# EAGLE design PowerMeter (EAGLE 7.3.0)
DATABASE: ../../../../digikeydb.txt
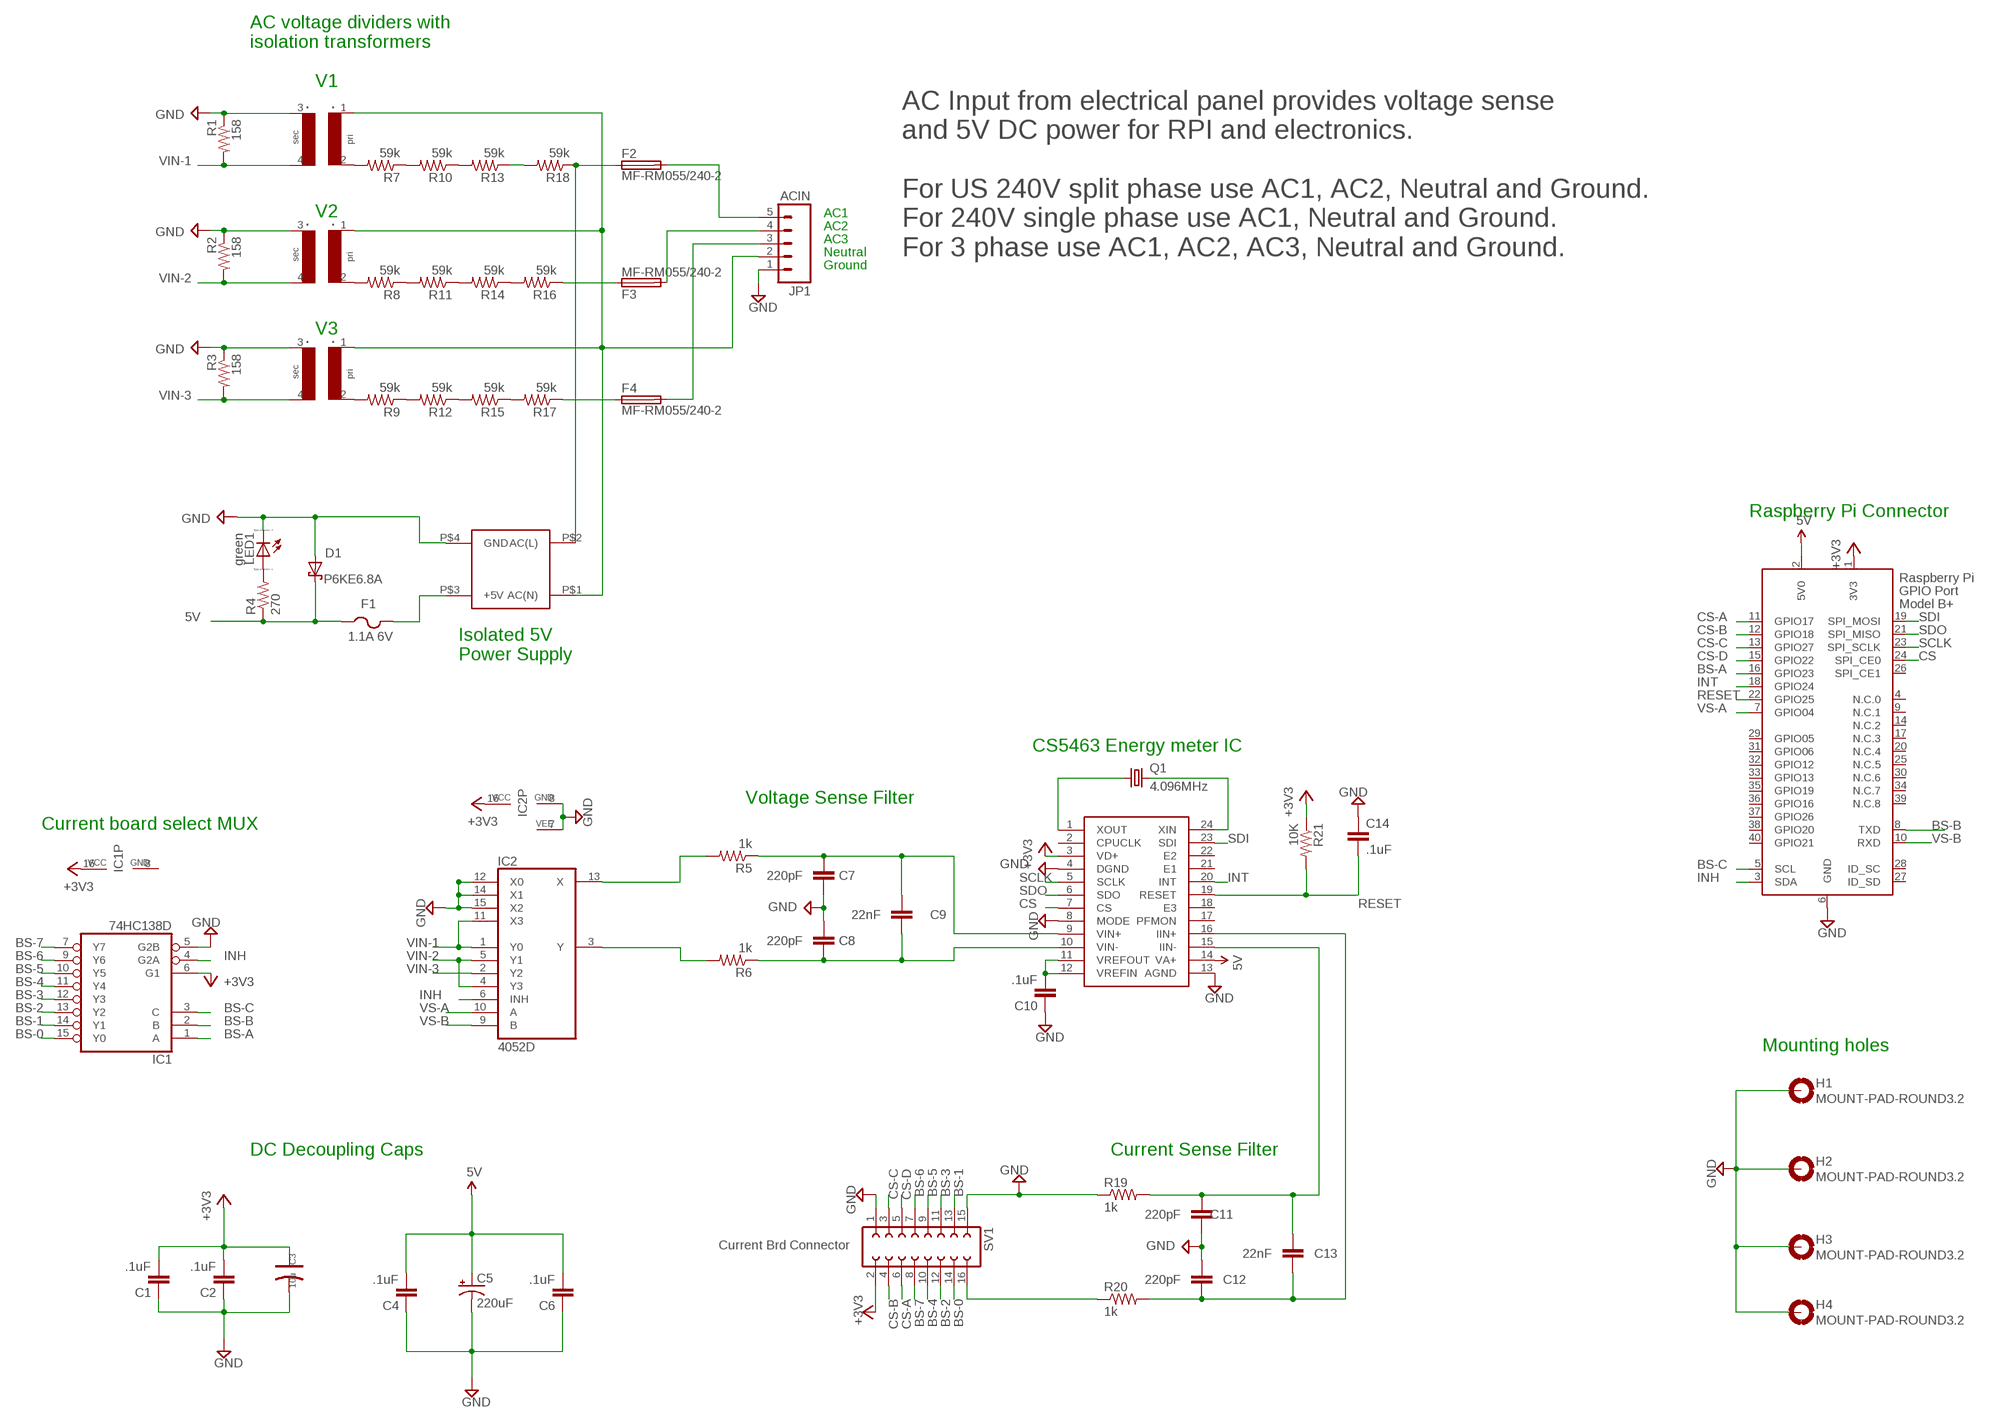
[diagram p0: schematic, sheet 1]

## Parts
C1  .1uF  C-EUC1206  [C1206]
C2  .1uF  C-EUC1206  [C1206]
C3  10u  CAP-AVX-C  [AVX-C]
C4  .1uF  C-EUC1206  [C1206]
C5  220uF  CPOL-USE2,5-6E  [E2,5-6E]
C6  .1uF  C-EUC1206  [C1206]
C7  220pF  C-EUC1206  [C1206]
C8  220pF  C-EUC1206  [C1206]
C9  22nF  C-EUC1206  [C1206]
C10  .1uF  C-EUC1206  [C1206]
C11  220pF  C-EUC1206  [C1206]
C12  220pF  C-EUC1206  [C1206]
C13  22nF  C-EUC1206  [C1206]
C14  .1uF  C-EUC1206  [C1206]
D1  P6KE6.8A  P6KEXXA  [C1702-15]
F1  1.1A 6V  PTCFUSE-1812  [1812]
F2  MF-RM055/240-2  FUSETE5  [TE5]
F3  MF-RM055/240-2  FUSETE5  [TE5]
F4  MF-RM055/240-2  FUSETE5  [TE5]
H1  MOUNT-PAD-ROUND3.2  [3,2-PAD]
H2  MOUNT-PAD-ROUND3.2  [3,2-PAD]
H3  MOUNT-PAD-ROUND3.2  [3,2-PAD]
H4  MOUNT-PAD-ROUND3.2  [3,2-PAD]
IC1  74HC138D  [SO16]
IC2  4052D  [SO16]
IC3  CS5463  [SSOP24]
JP1  ACIN  M05  [SCREWTERMINAL-5MM-5]
LED1  green  LED_E  [LED_1206]
PS1  VSK-S10  [VSK-S10]
Q1  4.096MHz  CRYSTALHC49S  [HC49/S]
R1  158  R-US_R1206  [R1206]
R2  158  R-US_R1206  [R1206]
R3  158  R-US_R1206  [R1206]
R4  270  R-US_R1206  [R1206]
R5  1k  R-US_R1206  [R1206]
R6  1k  R-US_R1206  [R1206]
R7  59k  R-US_R1206  [R1206]
R8  59k  R-US_R1206  [R1206]
R9  59k  R-US_R1206  [R1206]
R10  59k  R-US_R1206  [R1206]
R11  59k  R-US_R1206  [R1206]
R12  59k  R-US_R1206  [R1206]
R13  59k  R-US_R1206  [R1206]
R14  59k  R-US_R1206  [R1206]
R15  59k  R-US_R1206  [R1206]
R16  59k  R-US_R1206  [R1206]
R17  59k  R-US_R1206  [R1206]
R18  59k  R-US_R1206  [R1206]
R19  1k  R-US_R1206  [R1206]
R20  1k  R-US_R1206  [R1206]
R21  10K  R-US_R1206  [R1206]
SV1  Current Brd Connector  FE08-2  [FE08-2]
T1  TV16E  [TV16E]
T2  TV16E  [TV16E]
T3  TV16E  [TV16E]
X1  RASPI_BOARD_B+_E4  [RASPI_BOARD_B+_EDGES_4DRILL]

## Nets
5V: C4.2 C5.+ C6.2 D1.C F1.1 IC3.14(VA+) R4.1 X1.2(5V0)
+3V3: C1.2 C2.2 C3.+ IC1.6(G1) IC1.16(VCC) IC2.16(VCC) IC3.3(VD+) R21.1 SV1.2 X1.1(3V3)
+5V: F1.2 PS1.P$3(+5V)
AC(L) [ac line]: F2.1 PS1.P$2(AC(L)) R18.1
AC(N) [ac line]: JP1.2 PS1.P$1(AC(N)) T1.1 T2.1 T3.1
BS-0: IC1.15(Y0) SV1.14
BS-1: IC1.14(Y1) SV1.13
BS-2: IC1.13(Y2) SV1.12
BS-3: IC1.12(Y3) SV1.11
BS-4: IC1.11(Y4) SV1.10
BS-5: IC1.10(Y5) SV1.9
BS-6: IC1.9(Y6) SV1.7
BS-7: IC1.7(Y7) SV1.8
BS-A: IC1.1(A) X1.16(GPIO23)
BS-B: IC1.2(B) X1.8(TXD)
BS-C: IC1.3(C) X1.5(SCL)
C5: C12.1 C13.1 IC3.16(IIN+) R20.2
CS: IC3.7(CS) X1.24(SPI_CE0)
CS-A: SV1.6 X1.11(GPIO17)
CS-B: SV1.4 X1.12(GPIO18)
CS-C: SV1.3 X1.13(GPIO27)
CS-D: SV1.5 X1.15(GPIO22)
GND: C1.1 C2.1 C3.- C4.1 C5.- C6.1 C7.1 C8.2 C10.1 C11.1 C12.2 C14.1 D1.A H1.B3,2(MOUNT) H2.B3,2(MOUNT) H3.B3,2(MOUNT) H4.B3,2(MOUNT) IC1.5(G2B) IC2.7(VEE) IC2.8(GND) IC2.12(X0) IC2.14(X1) IC2.15(X2) IC3.4(DGND) IC3.8(MODE) IC3.13(AGND) JP1.1 LED1.C PS1.P$4(GND) R1.1 R2.1 R3.1 R19.1 SV1.1 SV1.15 T1.3 T2.3 T3.3 X1.6(GND)
IIN+: R20.1 SV1.16
INH: IC1.4(G2A) IC2.6(INH) X1.3(SDA)
INT: IC3.20(INT) X1.18(GPIO24)
N$1: IC3.1(XOUT) Q1.1
N$2 [ac line]: F3.1 R16.1
N$3 [ac line]: R7.1 R10.2
N$4 [ac line]: R10.1 R13.2
N$5 [ac line]: F4.2 JP1.3
N$6 [ac line]: R11.1 R14.2
N$7: LED1.A R4.2
N$8: C11.2 C13.2 IC3.15(IIN-) R19.2
N$9 [ac line]: F2.2 JP1.5
N$10 [ac line]: R15.1 R17.2
N$11 [ac line]: R9.2 T3.2
N$12: IC3.24(XIN) Q1.2
N$13 [ac line]: R9.1 R12.2
N$14 [ac line]: R12.1 R15.2
N$15 [ac line]: R8.2 T2.2
N$16 [ac line]: R8.1 R11.2
N$17: C10.2 IC3.11(VREFOUT) IC3.12(VREFIN)
N$18 [ac line]: R14.1 R16.2
N$19 [ac line]: R7.2 T1.2
N$20 [ac line]: R13.1 R18.2
N$21 [ac line]: F4.1 R17.1
N$23: IC2.13(X) R5.2
N$38 [ac line]: F3.2 JP1.4
N$39: IC2.3(Y) R6.2
N$46: C8.1 C9.1 IC3.10(VIN-) R6.1
R1: C7.2 C9.2 IC3.9(VIN+) R5.1
RESET: C14.2 IC3.19(RESET) R21.2 X1.22(GPIO25)
SCLK: IC3.5(SCLK) X1.23(SPI_SCLK)
SDI: IC3.23(SDI) X1.19(SPI_MOSI)
SDO: IC3.6(SDO) X1.21(SPI_MISO)
VIN-1: IC2.1(Y0) IC2.11(X3) R1.2 T1.4
VIN-2: IC2.4(Y3) IC2.5(Y1) R2.2 T2.4
VIN-3: IC2.2(Y2) R3.2 T3.4
VS-A: IC2.10(A) X1.7(GPIO04)
VS-B: IC2.9(B) X1.10(RXD)
Unconnected: IC3.2(CPUCLK) IC3.17(PFMON) IC3.18(E3) IC3.21(E1) IC3.22(E2) X1.4(N.C.0) X1.9(N.C.1) X1.14(N.C.2) X1.17(N.C.3) X1.20(N.C.4) X1.25(N.C.5) X1.26(SPI_CE1) X1.27(ID_SD) X1.28(ID_SC) X1.29(GPIO05) X1.30(N.C.6) X1.31(GPIO06) X1.32(GPIO12) X1.33(GPIO13) X1.34(N.C.7) X1.35(GPIO19) X1.36(GPIO16) X1.37(GPIO26) X1.38(GPIO20) X1.39(N.C.8) X1.40(GPIO21)

## Notes on the sheet
- AC voltage dividers with
  isolation transformers
- V1
- V2 | AC1
- AC2
- AC3
- Neutral
- AC Input from electrical panel provides voltage sense 
  and 5V DC power for RPI and electronics.
  
  For US 240V split phase use AC1, AC2, Neutral and Ground.
  For 240V single phase use AC1, Neutral and Ground.
  For 3 phase use AC1, AC2, AC3, Neutral and Ground.
- Ground
- V3
- Raspberry Pi Connector
- Isolated 5V
  Power Supply
- CS5463 Energy meter IC
- Voltage Sense Filter
- Current board select MUX
- Mounting holes
- DC Decoupling Caps | Current Sense Filter

## Power pins joined to a net without a drawn wire
GND: IC1.8(GND)

## Library data of the parts
C1 C2 C4 C6 C10 C14 = rcl:C-EU: CAPACITOR, European symbol; PARTNO: C1206C104K5RAC7867
C3 = Discrete:CAP*: Electrolytic Capacitors,Tantalum Capacitors and Super Capacitors; PARTNO: T491C106K016AT
C5 = adafruit:CPOL-US: POLARIZED CAPACITOR, American symbol; PARTNO: ESH227M016AE3AA
C7 C8 C11 C12 = rcl:C-EU: CAPACITOR, European symbol; PARTNO: C1206C221J5GACTU
C9 C13 = rcl:C-EU: CAPACITOR, European symbol; PARTNO: C1206C223K5RACTU
D1 = diode:P6KEXXA: DIODE transient-voltage suppressor; PARTNO: P6KE6.8A
F1 = adafruit:PTCFUSE: PTC fuses, resettable thermistors; PARTNO: 0ZCC0110AF2C
F2-F4 = fuse:FUSE: Fuse; OC_FARNELL: unknown; OC_NEWARK: unknown; PARTNO: MF-RM055/240-2
H1-H4 = holes:MOUNT-PAD-ROUND: MOUNTING PAD, round; BOM: EXCLUDE
IC1 = 74xx-eu:74*138: 3-line to 8-line DECODER/DEMULTIPLEXER; PARTNO: SN74HC138NSR
IC2 = 40xx:4052: Dual 4-channel ANALOG MULTIPLEXER; PARTNO: CD4052BNSR
IC3 = Cirrus_Logic_By_element14_Batch_1:CS5463; PARTNO: CS5463-ISZ
JP1 = SparkFun-Connectors:M05: Header 5 Standard 5-pin 0.1" header. Use with straight break away headers (SKU : PRT-00116), right angle break away headers (PRT-00553), swiss pins (PRT-00743), machine pins (PRT-00117), and female headers (PRT-00115). Molex polarized connector foot print use with SKU : PRT-08230 with associated crimp pins and housings.; PARTNO: 1935190
LED1 = eagle-ltspice:LED_E: LED Source: http://www.osram.convergy.de Source: www.luxeon.com Source: www.kingbright.com; PARTNO: LTST-C150GKT; SPICEMODEL: NONE; SPICEPREFIX: D; SPICETYPE: diode
PS1 = CraigJensen:VSK-S10; PARTNO: VSK-S5-5UA
Q1 = crystal:CRYSTAL: CRYSTAL; OC_FARNELL: 1667008; OC_NEWARK: unknown; PARTNO: 9B-4.096MBBK-B
R1-R3 = resistor:R-US_: RESISTOR, American symbol; PARTNO: RC1206FR-07158RL
R4 = resistor:R-US_: RESISTOR, American symbol; PARTNO: RC1206FR-07270RL
R5-R20 = resistor:R-US_: RESISTOR, American symbol; PARTNO: RC1206FR-071KL
R21 = resistor:R-US_: RESISTOR, American symbol; PARTNO: RC1206FR-0710KL
SV1 = con-lsta:FE08-2: FEMALE HEADER; OC_FARNELL: unknown; OC_NEWARK: unknown; PARTNO: PPTC082LFBN-RC
T1-T3 = CraigJensen:TV16E: YHDC TV16E Transformer
X1 = raspberrypi_bastelstube_v13:RASPI_BOARD_B+: Raspberry Pi GPIO connector with markings for the outer dimensions of the Raspberry Pi board model B+ with different sets of drill holes or mounting pads; PARTNO: M20-9762046

## Net classes
1 ac line: width 0.4 mm, clearance 1.2 mm

## Board
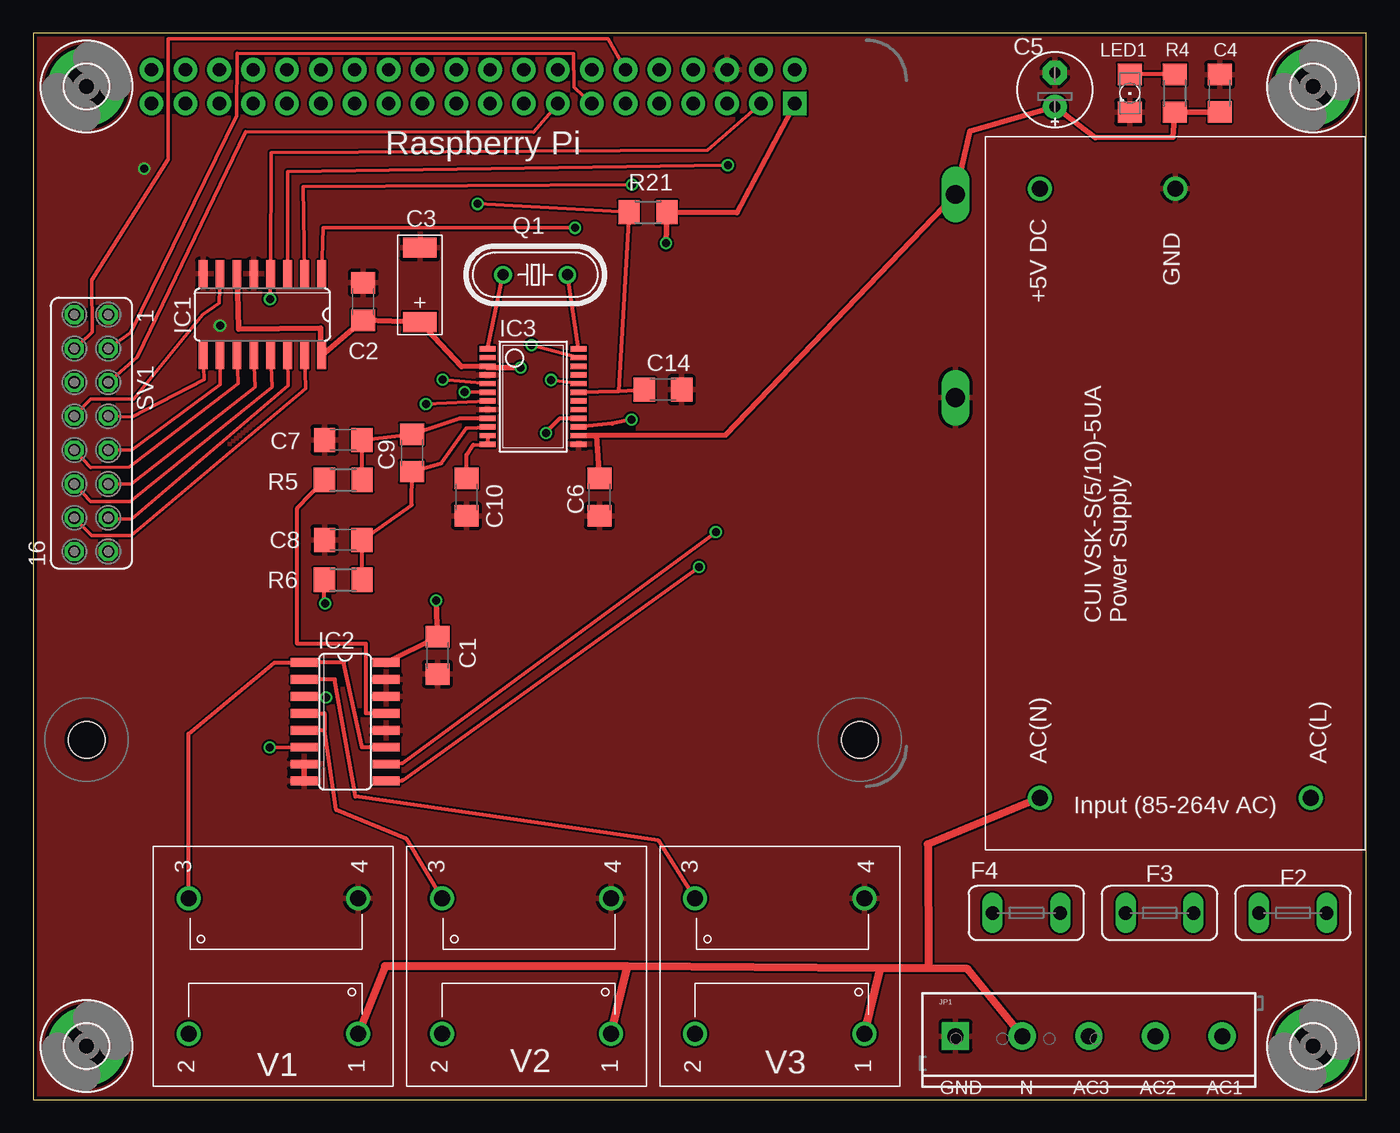
[diagram p1: board, top side]
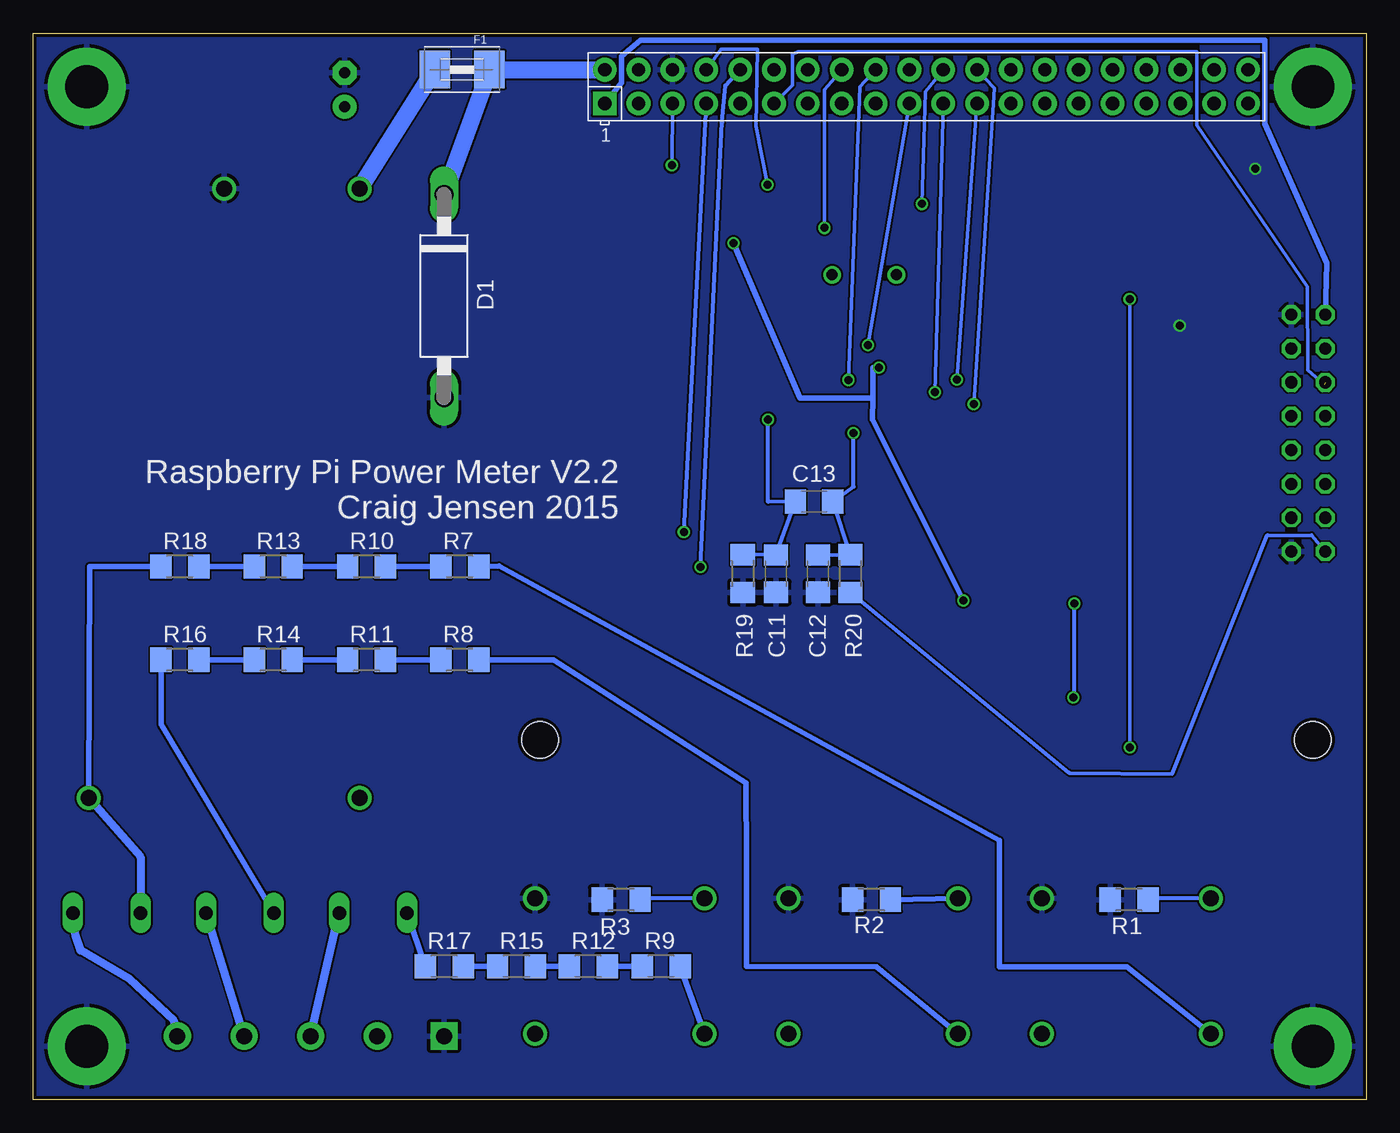
[diagram p2: board, bottom side, seen from below]

Size 100 x 80 mm. Coordinates in mm from the lower left corner, seen from the top.
Outline: 0,0 100,0 100,80 0,80 0,0
Copper layers (1*16): Top 0.035mm / dielectric 1.5mm / Bottom 0.035mm
Design rules "Elecrow_2-layer_eagle_rule": minimum track width 6mil, minimum drill 12mil, track to track 6mil, track to pad 6mil, pad to pad 6mil, via to via 6mil, smd to smd 0mil, copper to edge 10mil, drill to drill 10mil, minimum pad ring 10mil, minimum via ring 6mil, stop-mask expansion 2mil, vias tented up to drill 100mil, thermal gap 10mil

### Footprints (pad centres in the part's own frame; a part is rotated, then mirrored left to right if it is on the bottom)
C1206 = smd 1.6 x 1.8: 1 -1.4,0; 2 1.4,0
AVX-C = smd 1.524 x 2.54: + -2.794,0; - 2.794,0
E2,5-6E = drill 0.813 pad 1.778: + -1.27,0 | drill 0.813 pad 1.778 octagon: - 1.27,0
C1702-15 = drill 1.397 long: A 7.62,0; C -7.62,0
1812 = smd 2.286 x 2.794: 1 -2.046,0; 2 2.046,0
TE5 = drill 1.016 long: 1 -2.54,0; 2 2.54,0
3,2-PAD = drill 3.2 pad 5.842: B3,2 0,0
SO16 = smd 0.66 x 2.032: 1 -4.445,-3.073; 2 -3.175,-3.073; 3 -1.905,-3.073; 4 -0.635,-3.073; 5 0.635,-3.073; 6 1.905,-3.073; 7 3.175,-3.073; 8 4.445,-3.073; 9 4.445,3.073; 10 3.175,3.073; 11 1.905,3.073; 12 0.635,3.073; 13 -0.635,3.073; 14 -1.905,3.073; 15 -3.175,3.073; 16 -4.445,3.073
SSOP24 = smd 0.4 x 1.2: 1 -3.575,-3.42; 2 -2.925,-3.42; 3 -2.275,-3.42; 4 -1.625,-3.42; 5 -0.975,-3.42; 6 -0.325,-3.42; 7 0.325,-3.42; 8 0.975,-3.42; 9 1.625,-3.42; 10 2.275,-3.42; 11 2.925,-3.42; 12 3.575,-3.42; 13 3.575,3.42; 14 2.925,3.42; 15 2.275,3.42; 16 1.625,3.42; 17 0.975,3.42; 18 0.325,3.42; 19 -0.325,3.42; 20 -0.975,3.42; 21 -1.625,3.42; 22 -2.275,3.42; 23 -2.925,3.42; 24 -3.575,3.42
SCREWTERMINAL-5MM-5 = drill 1.2 pad 2.032 square: 1 2.53,4.46 | drill 1.2 pad 2.032: 2 7.53,4.46; 3 12.53,4.46; 4 17.53,4.46; 5 22.53,4.46
LED_1206 = smd 1.6 x 1.803: A -1.422,0; C 1.422,0
VSK-S10 = drill 1.2: P$1 -22.86,10.16; P$2 -22.86,-10.16; P$3 22.86,10.16; P$4 22.86,0
HC49/S = drill 0.813: 1 -2.413,0; 2 2.413,0
R1206 = smd 1.6 x 1.803: 1 -1.422,0; 2 1.422,0
FE08-2 = drill 0.914 octagon: 1 -8.89,1.27; 2 -8.89,-1.27; 3 -6.35,1.27; 4 -6.35,-1.27; 5 -3.81,1.27; 6 -3.81,-1.27; 7 -1.27,1.27; 8 -1.27,-1.27; 9 1.27,1.27; 10 1.27,-1.27; 11 3.81,1.27; 12 3.81,-1.27; 13 6.35,1.27; 14 6.35,-1.27; 15 8.89,1.27; 16 8.89,-1.27
TV16E = drill 1.2: 1 -5.08,-6.35; 2 -5.08,6.35; 3 5.08,-6.35; 4 5.08,6.35
RASPI_BOARD_B+_EDGES_4DRILL = drill 1 pad 1.778 square: 1 8.37,51.23 | drill 1 pad 1.778: 2 8.37,53.77; 3 10.91,51.23; 4 10.91,53.77; 5 13.45,51.23; 6 13.45,53.77; 7 15.99,51.23; 8 15.99,53.77; 9 18.53,51.23; 10 18.53,53.77; 11 21.07,51.23; 12 21.07,53.77; 13 23.61,51.23; 14 23.61,53.77; 15 26.15,51.23; 16 26.15,53.77; 17 28.69,51.23; 18 28.69,53.77; 19 31.23,51.23; 20 31.23,53.77; 21 33.77,51.23; 22 33.77,53.77; 23 36.31,51.23; 24 36.31,53.77; 25 38.85,51.23; 26 38.85,53.77; 27 41.39,51.23; 28 41.39,53.77; 29 43.93,51.23; 30 43.93,53.77; 31 46.47,51.23; 32 46.47,53.77; 33 49.01,51.23; 34 49.01,53.77; 35 51.55,51.23; 36 51.55,53.77; 37 54.09,51.23; 38 54.09,53.77; 39 56.63,51.23; 40 56.63,53.77 | hole 2.75: 61.5,3.5; 3.5,3.5

### Placement (x,y rotation side)
C1  30.32,33.33 90 top
C2  24.75,59.88 270 top
C3  29,61.12 90 top
C4  89,75.5 270 top
C5  76.64,75.77 90 top
C6  42.48,45.2 90 top
C7  23.25,49.5 0 top
C8  23.25,42 180 top
C9  28.41,48.52 90 top
C10  32.5,45.2 90 top
C11  44.27,39.46 90 bottom
C12  41.12,39.46 270 bottom
C13  41.41,44.86 180 bottom
C14  47.24,53.26 180 top
D1  69.19,60.28 270 bottom
F1  67.83,77.28 180 bottom
F2  94.5,14 0 top
F3  84.5,14 0 top
F4  74.5,14 0 top
H1  96,76 0 top
H2  96,4 0 top
H3  4,4 0 top
H4  4,76 0 top
IC1  17.18,58.89 180 top
IC2  23.39,28.34 270 top
IC3  37.5,52.75 270 top
JP1  66.66,0.3 0 top
LED1  82.27,75.5 270 top
PS1  85.67,45.5 90 top
Q1  37.66,61.88 0 top
R1  17.79,15 0 bottom
R2  37.11,15 0 bottom
R3  55.9,15 0 bottom
R4  85.63,75.5 90 top
R5  23.25,46.5 180 top
R6  23.25,39 180 top
R7  68,40 0 bottom
R8  68,33 0 bottom
R9  52.89,10 0 bottom
R10  75,40 0 bottom
R11  75,33 0 bottom
R12  58.37,10 0 bottom
R13  82,40 0 bottom
R14  82,33 0 bottom
R15  63.75,10 0 bottom
R16  89,33 0 bottom
R17  69.17,10 0 bottom
R18  89,40 0 bottom
R19  46.77,39.46 90 bottom
R20  38.7,39.46 90 bottom
R21  46.12,66.57 180 top
SV1  4.35,50 270 top
T1  18,10 90 top
T2  37,10 90 top
T3  56,10 90 top
X1  65.5,23.5 0 bottom

### Tracks (layer width: path | path; a pad name or v marks a point on that pad's centre or on a via)
5V
  Top 0.406: IC3.14 42.25,49.83 | 42.25,49.83 51.92,49.84 D1.C 70.26,72.66 C5.+ 79.69,72.18 85.5,72.22 R4.1 C4.2 | C6.2 42.25,49.83
  Bottom 1.27: X1.2 F1.1 D1.C
+3V3  (via drill 0.6)
  Top 0.406: v47.47,64.24 R21.1 52.8,66.53 X1.1 | IC2.16 C1.2 30.26,36.48 v30.21,37.44 | IC1.6 15.4,57.81 21.56,57.9 21.56,55.07 IC1.16 C2.2 C3.+ 32.12,55 IC3.3 34.08,54.93 v36.55,54.93
  Bottom 0.406: v47.47,64.24 42.47,52.63 36.99,52.63 | SV1.2 2.97,62.77 7.62,73.2 7.62,79.5 54.46,79.5 55.86,78.3 55.87,76.3 X1.1 | v30.21,37.44 37.03,51.01 36.99,52.63 | 36.99,52.63 36.99,54.93 v36.55,54.93
+5V
  Bottom 1.27: PS1.P$3 F1.2
AC(L)
  Bottom 0.406: R18.1 95.78,39.99 PS1.P$2
  Bottom 0.61: PS1.P$2 91.95,18.2 F2.1
AC(N)
  Top 0.61: JP1.2 70.09,9.79 67.15,9.86 | 67.15,9.86 63.56,9.86 | 63.56,9.86 44.58,10 | 44.58,10 26.38,10 T1.1 | T2.1 44.58,10 | T3.1 63.56,9.86 | PS1.P$1 67.1,19.15 67.15,9.86
BS-0
  Top 0.254: IC1.15 20.43,53.34 7.33,42.32 4.38,42.33 SV1.14
BS-1
  Top 0.254: IC1.14 19.12,53.58 7.38,43.57 5.7,43.57 SV1.13
BS-2
  Top 0.254: IC1.13 17.93,53.47 7.26,44.87 4.3,44.87 SV1.12
BS-3
  Top 0.254: IC1.12 16.63,53.46 7.34,46.2 SV1.11
BS-4
  Top 0.254: IC1.11 15.38,53.7 7.21,47.45 4.3,47.41 SV1.10
BS-5
  Top 0.254: IC1.10 14,53.65 7.38,48.73 SV1.9
BS-6
  Top 0.254: IC1.9 12.81,54.02 7.38,51.23 SV1.7
BS-7
  Top 0.254: IC1.7 13.94,59.77 12.69,58.9 7.53,52.55 4.3,52.55 SV1.8
BS-A  (via drill 0.6)
  Top 0.254: v40.64,65.4 21.75,65.4 IC1.1
  Bottom 0.254: X1.16 40.64,75.76 v40.64,65.4
BS-B  (via drill 0.6)
  Top 0.254: IC1.2 20.26,68.5 v44.92,68.63
  Bottom 0.254: v44.92,68.63 45.79,73.03 45.66,78.8 48.39,78.8 X1.8
BS-C  (via drill 0.6)
  Top 0.254: IC1.3 19.08,69.62 v52.1,70.09
  Bottom 0.254: v52.1,70.09 X1.5
C5  (via drill 0.6)
  Top 0.305: v38.48,49.99 38.48,50.09 39.53,51.13 IC3.16
  Bottom 0.305: v38.48,49.99 38.46,45.99 C13.1 R20.2 C12.1
CS  (via drill 0.6)
  Top 0.254: v29.45,52.18 IC3.7
  Bottom 0.254: X1.24 27.88,75.88 v29.45,52.18
CS-A  (1 unrouted)
  Bottom 0.254: 3.13,53.65 4.37,54.72 4.42,60.99 12.7,73.09 12.72,78.61 42.62,78.61 43.06,78.42 43.06,76.1 X1.11
CS-B
  Top 0.254: X1.12 43.13,79.6 10.11,79.6 10.13,70.55 4.37,61.5 4.43,57.58 4.16,57.32 SV1.4
CS-C
  Top 0.254: X1.13 40.58,75.94 40.52,78.48 15.3,78.49 15.24,73.81 7.32,57.54 SV1.3
CS-D
  Top 0.254: X1.15 37.53,72.6 15.94,72.61 7.78,55.7 SV1.5
GND  (via drill 0.6)
  Top 0.406: IC2.7 IC2.8
  other vias: 14,58.08 8.33,69.86
  pour Bottom: 101.38,81.12 101.86,-1 -1.12,-0.88 -1,34 -0.88,81.12
  pour Top: 101.38,81.25 101.31,-1 -2,-0.75 -2,81.25
IIN+
  Bottom 0.254: 4.1,42.32 SV1.16
  Bottom 0.305: R20.1 22.3,24.52 14.55,24.45 7.41,42.35 4.1,42.32
INH  (via drill 0.6)
  Top 0.254: IC2.6 v17.75,26.43 | v17.75,60.06 IC1.4 17.84,71.05 50.57,71.25 X1.3
  Bottom 0.254: v17.75,60.06 17.75,42.12 v17.75,26.43
INT  (via drill 0.6)
  Top 0.254: v38.84,54 IC3.20
  Bottom 0.254: X1.18 37.99,76.01 v38.84,54
N$1
  Top 0.305: IC3.1 Q1.1
N$2
  Bottom 0.406: F3.1 90.41,28.14 R16.1
N$3
  Bottom 0.406: R7.1 R10.2
N$4
  Bottom 0.406: R10.1 R13.2
N$5
  Bottom 0.61: JP1.3 F4.2
N$6
  Bottom 0.406: R14.2 R11.1
N$7
  Top 0.305: R4.2 LED1.A
N$8  (via drill 0.6)
  Top 0.305: v44.87,51.03 43.43,50.7 IC3.15
  Bottom 0.305: v44.87,51.03 44.88,44.84 C13.2 C11.2 R19.2
N$9
  Bottom 0.61: JP1.5 89.44,5.89 92.82,9.07 96.46,11.18 96.83,12.29 F2.2
N$10
  Bottom 0.406: R15.1 R17.2
N$11
  Bottom 0.406: R9.2 T3.2
N$12
  Top 0.305: IC3.24 Q1.2
N$13
  Bottom 0.406: R9.1 R12.2
N$14
  Bottom 0.406: R12.1 R15.2
N$15
  Bottom 0.406: T2.2 36.73,9.96 46.49,9.98 46.5,17.96 46.52,23.76 60.98,33 R8.2
N$16
  Bottom 0.406: R11.2 R8.1
N$17
  Top 0.305: IC3.11 IC3.12 33,49.12 32.5,48.38 C10.2
N$18
  Bottom 0.406: R16.2 R14.1
N$19
  Bottom 0.406: T1.2 17.96,9.96 27.51,9.96 27.51,19.44 65.05,40.03 R7.2
N$20
  Bottom 0.406: R13.1 R18.2
N$21
  Bottom 0.406: R17.1 F4.1
N$23
  Top 0.305: IC2.13 24.95,28.98 24.96,34.2 19.8,34.19 19.8,44.37 R5.2
N$38
  Bottom 0.61: JP1.4 F3.2
N$39  (via drill 0.6)
  Top 0.305: v21.89,37.21 21.83,37.21 R6.2
  Top 0.406: IC2.3 21.96,30.25 v21.96,30.18
  Bottom 0.305: v21.96,30.18 21.89,30.18 v21.89,37.21
N$46
  Top 0.305: R6.1 C8.1 28.39,44.62 C9.1 30.62,47.75 32.5,50.38 IC3.10
R1
  Top 0.305: R5.1 C7.2 C9.2 32,51.12 IC3.9
RESET  (via drill 0.6)
  Top 0.254: v33.33,67.2 R21.2
  Top 0.305: IC3.19 43.89,53.15 | 43.89,53.15 C14.2 | R21.2 43.89,53.15
  Bottom 0.254: X1.22 33.06,75.63 v33.33,67.2
SCLK  (via drill 0.6)
  Top 0.254: v30.7,54.02 IC3.5
  Bottom 0.254: X1.23 v30.7,54.02
SDI  (via drill 0.6)
  Top 0.254: v37.39,56.6 IC3.23
  Bottom 0.254: X1.19 v37.39,56.6
SDO  (via drill 0.6)
  Top 0.254: IC3.6 v32.36,53.07
  Bottom 0.254: v32.36,53.07 X1.21
VIN-1
  Top 0.305: T1.4 11.65,27.45 18.1,32.79 IC2.1 23.29,32.79 24.65,26.46 24.65,26.43 IC2.11
  Bottom 0.305: T1.4 16.37,15.08 R1.2
VIN-2
  Top 0.305: 21.84,27.7 22.72,21.72 28,19.55 T2.4 | 21.84,27.7 IC2.5 | IC2.4 21.85,28.98 21.84,27.7
  Bottom 0.406: T2.4 R2.2
VIN-3
  Top 0.305: T3.4 46.9,19.43 24.17,22.73 22.61,31.53 IC2.2
  Bottom 0.305: T3.4 54.48,15.08 R3.2
VS-A  (via drill 0.6)
  Top 0.305: IC2.10 27.7,25.24 v51.2,42.59
  Bottom 0.305: v51.2,42.59 X1.7
VS-B  (via drill 0.6)
  Top 0.305: IC2.9 27.7,23.96 v49.93,39.96
  Bottom 0.305: v49.93,39.96 48.32,73.33 48.08,76.07 X1.10

### Text on the board
tNames: Raspberry Pi | V1 | V2 | V3 | GND | N | AC3 | AC2 | AC1
bNames: Raspberry Pi Power Meter V2.2 / Craig Jensen 2015